# Altium schematic sheet SAML21_Xplained_Pro_current_measurement_frontend.SchDoc: Current measurement frontend
size A3; Organization: ATMEL Norway; Address1: Vestre Rosten 79; Address2: N-7075 TILLER; Address3: NORWAY; DocumentNumber: A09-2241; Revision: 4; SheetNumber: 8; SheetTotal: 10; PageSetup: Record=PageOptions|CenterHorizontal=True|CenterVertical=True|PrintScale=1.01|XCorrection=1.00|YCorrection=1.00|PrintKind=1|BorderSize=5000000|LeftOffset=0|BottomOffset=0|Orientation=2|PaperLength=1000|PaperWidth=1000|Scale=100|PaperSource=7|PrintQuality=-4|MediaType=1|DitherType=10|PaperKind=A3 (297 x 420 mm)|PrintScaleMode=1
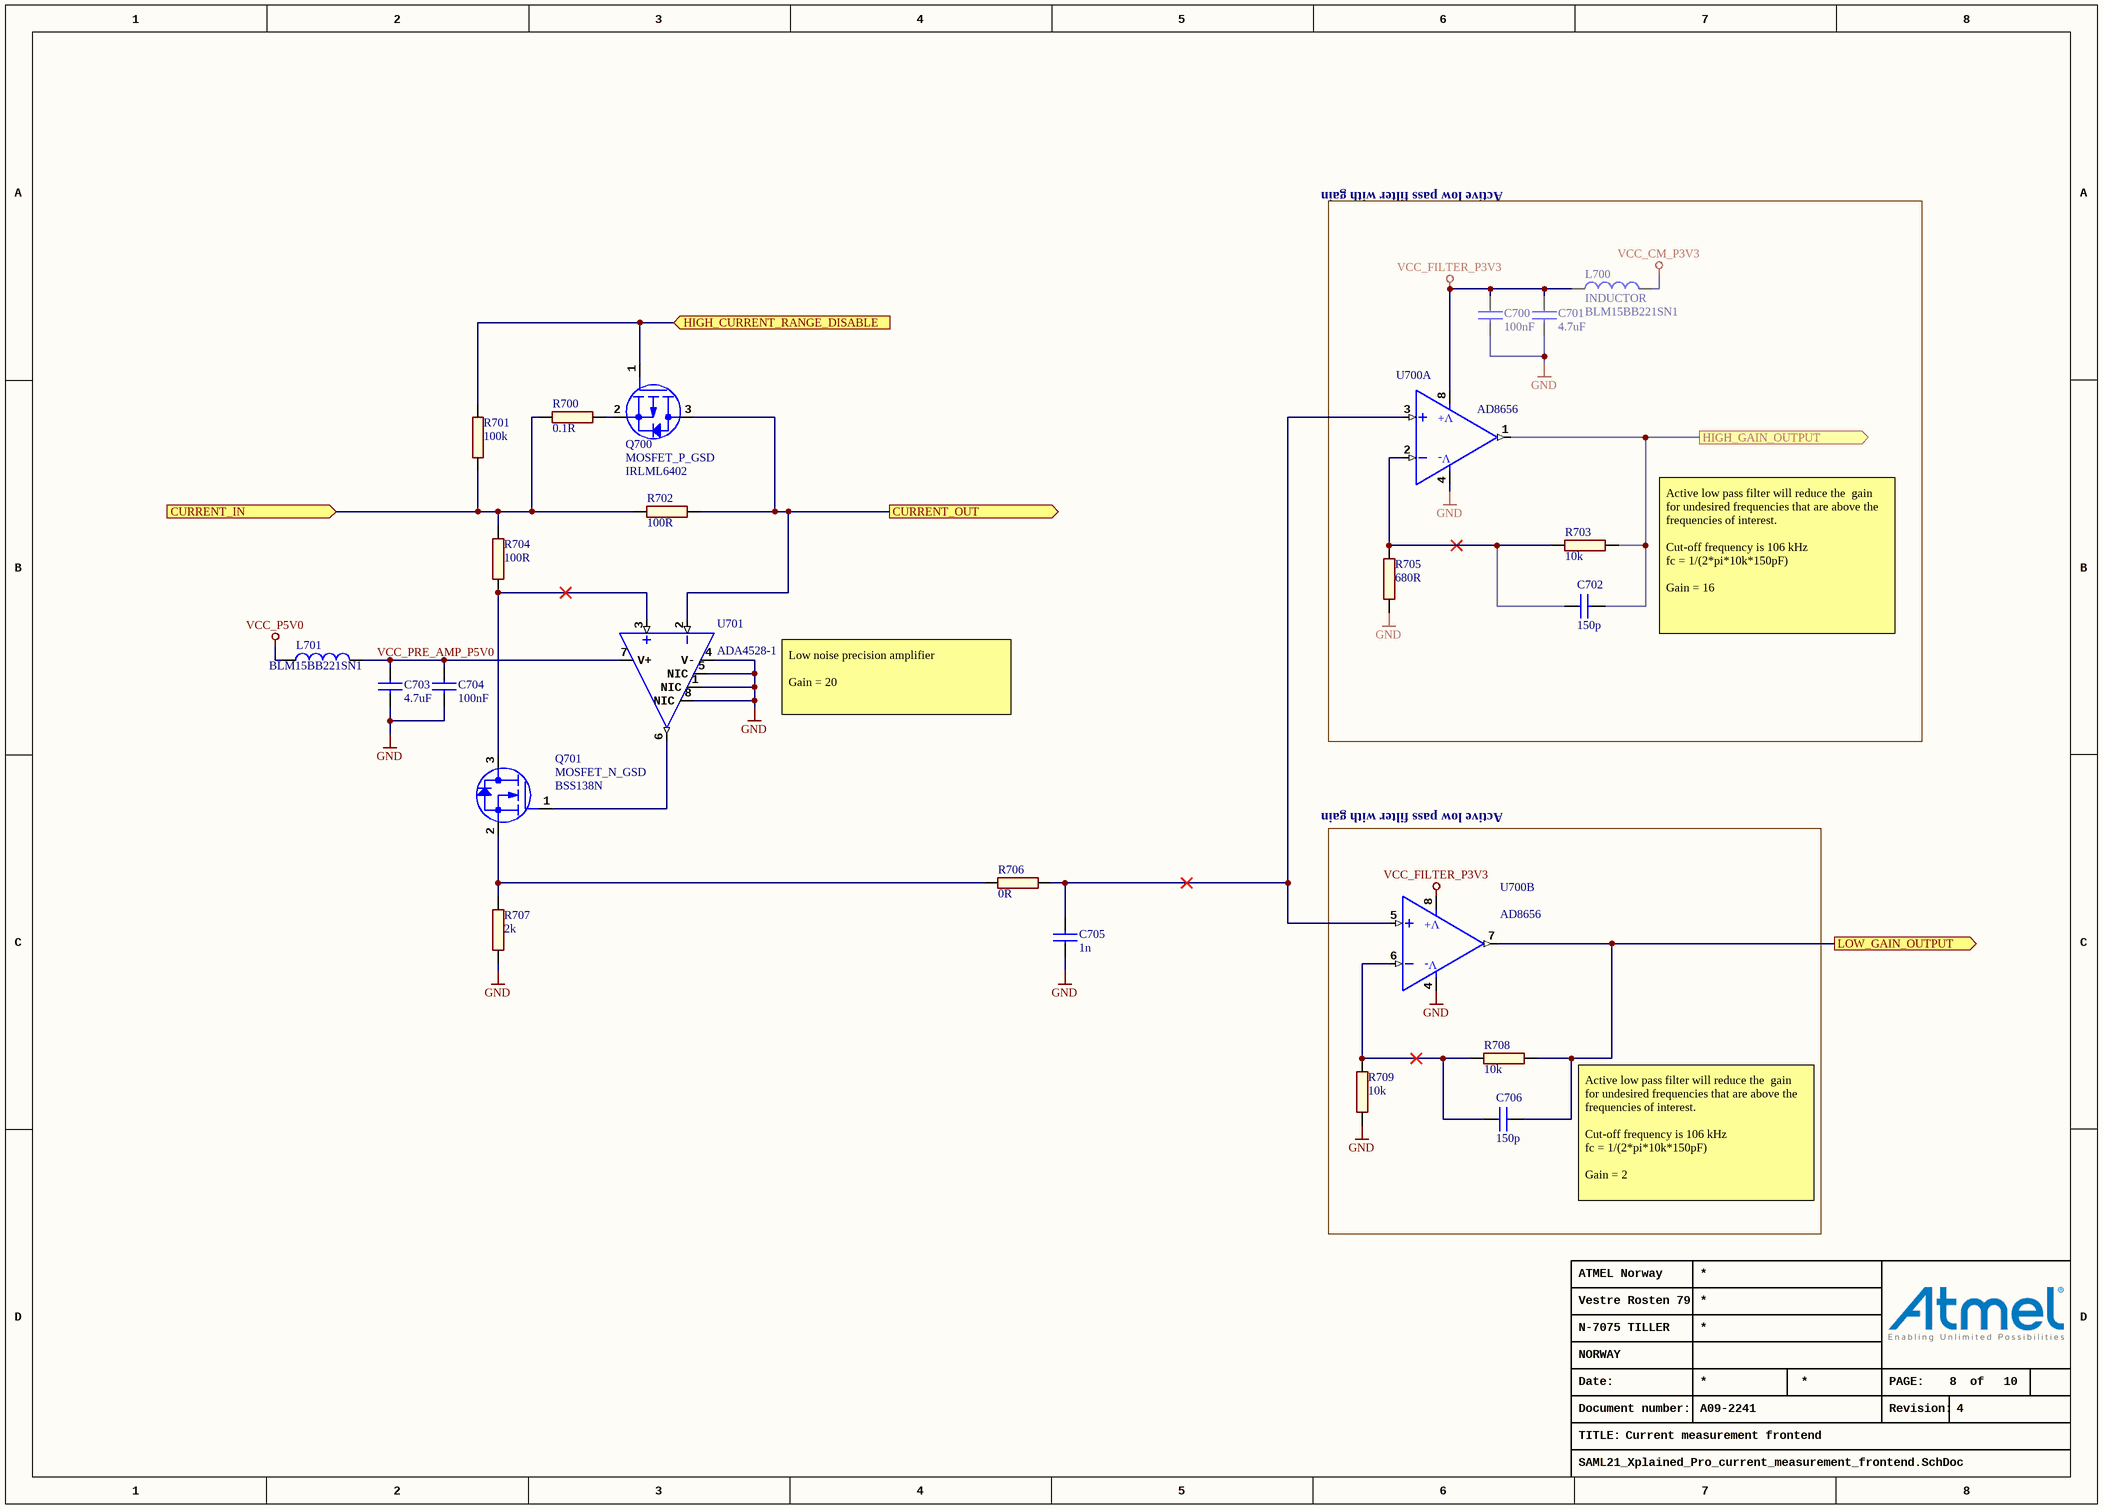
[diagram p0: SAML21_Xplained_Pro_current_measurement_frontend.SchDoc]

## Parts
C700  value 100nF  [AP1-00053]  (hidden comment: CAP-NONPOL)
C701  value 4.7uF  [AP1-00117]  (hidden comment: CAP-NONPOL)
C702  value 150p  [AP1-00053]  (hidden comment: CAP-NONPOL)
C703  value 4.7uF  [AP1-00117]  (hidden comment: CAP-NONPOL)
C704  value 100nF  [AP1-00053]  (hidden comment: CAP-NONPOL)
C705  value 1n  [AP1-00053]  (hidden comment: CAP-NONPOL)
C706  value 150p  [AP1-00053]  (hidden comment: CAP-NONPOL)
L700  INDUCTOR  value BLM15BB221SN1  [AP3-00028]
L701  value BLM15BB221SN1  [AP3-00028]  (hidden comment: INDUCTOR)
Q700  MOSFET_P_GSD  value IRLML6402  [AP5-00002]
Q701  MOSFET_N_GSD  value BSS138N  [AP5-00002]
R700  value 0.1R  [AP2-00076]  (hidden comment: R2)
R701  value 100k  [AP2-00011]  (hidden comment: R2)
R702  value 100R  [AP2-00076]  (hidden comment: R2)
R703  value 10k  [AP2-00011]  (hidden comment: R2)
R704  value 100R  [AP2-00076]  (hidden comment: R2)
R705  value 680R  [AP2-00011]  (hidden comment: R2)
R706  value 0R  [AP2-00011]  (hidden comment: R2)
R707  value 2k  [AP2-00076]  (hidden comment: R2)
R708  value 10k  [AP2-00011]  (hidden comment: R2)
R709  value 10k  [AP2-00011]  (hidden comment: R2)
U700  AD8656  [AP6-00100]  (parts A,B of 2)
U701  ADA4528-1  [AP6-00100]

## Blocks framed on the sheet
Active low pass filter with gain: C700-C702 L700 R703 R705 U700

## Ports
CURRENT_IN (in), CURRENT_OUT (out), HIGH_CURRENT_RANGE_DISABLE (in), HIGH_GAIN_OUTPUT (out), LOW_GAIN_OUTPUT (out)

## Nets
GND: C700.2 C701.2 C703.2 C704.2 C705.1 R705.1 R707.1 R709.1 U700.4(V-) U701.1(NIC) U701.4(V-) U701.5(NIC) U701.8(NIC)
VCC_CM_P3V3: L700.1
VCC_FILTER_P3V3: C700.1 C701.1 L700.2 U700.8(V+)
VCC_P5V0: L701.1
CURRENT_IN: R700.1 R701.1 R702.1 R704.2 ; port CURRENT_IN
CURRENT_OUT: Q700.3(D) R702.2 U701.2(IN-) ; port CURRENT_OUT
HIGH_CURRENT_RANGE_DISABLE: Q700.1(G) R701.2 ; port HIGH_CURRENT_RANGE_DISABLE
HIGH_GAIN_OUTPUT: C702.2 R703.2 U700.1(OUTA) ; port HIGH_GAIN_OUTPUT
LOW_GAIN_OUTPUT: C706.2 R708.2 U700.7(OUTB) ; port LOW_GAIN_OUTPUT
VCC_PRE_AMP_P5V0: C703.1 C704.1 L701.2 U701.7(V+)
NetC702_1: C702.1 R703.1 R705.2 U700.2(INA_-)
NetC705_2: C705.2 R706.1 U700.3(INA_+) U700.5(INB_+)
NetC706_1: C706.1 R708.1 R709.2 U700.6(INB_-)
NetQ700_2: Q700.2(S) R700.2
NetQ701_1: Q701.1(G) U701.6(OUT)
NetQ701_2: Q701.2(S) R706.2 R707.2
NetQ701_3: Q701.3(D) R704.1 U701.3(IN+)

## Notes on the sheet
- Active low pass filter will reduce the  gain for undesired frequencies that are above the frequencies of interest.
  Cut-off frequency is 106 kHz
  fc = 1/(2*pi*10k*150pF)
  Gain = 16
- Low noise precision amplifier
  Gain = 20
- Active low pass filter with gain
- Active low pass filter will reduce the  gain for undesired frequencies that are above the frequencies of interest.
  Cut-off frequency is 106 kHz
  fc = 1/(2*pi*10k*150pF)
  Gain = 2
- Date:
- PAGE:
- of
- TITLE:
- Document number:
- Revision:

## Library data of the parts
C700 C704 = A01-0416: Ceramic capacitor, SMD 0402, High Density Footprint; PartGroup: Capacitors,Ceramic,SMD 0402; Tolerance: 50V, +/-0.25pF; TemperatureRange: -55 - +125 deg C; AN: A01-0416; Height: 0.550000011920929
C701 C703 = A01-0377: Ceramic capacitor, SMD 0603, X5R, 10V, 10% (de31036); PartGroup: Capacitors,Ceramic,SMD 0603; Manufacturer: tdk; MPN: C1608X5R1A475K; TemperatureRange: -55 - +85 deg C; AN: A01-0377; Tolerance: 10%; Height: 0.800000011920929
C702 C706 = A01-0028: Ceramic capacitor, SMD 0402, X7R, 50V, +/-10%; PartGroup: Capacitors,Ceramic,SMD 0402; TemperatureRange: -55 - +125 deg C; AN: A01-0028; Tolerance: 50V, +/-10%; Height: 0.550000011920929
C705 = A01-0038: Ceramic capacitor, SMD 0402, X7R, 50V, +/-10%; PartGroup: Capacitors,Ceramic,SMD 0402; TemperatureRange: -55 - +125 deg C; AN: A01-0038; Tolerance: 50V, +/-10%; Height: 0.550000011920929
L700 L701 = A03-0037: SMD RF inductor 0402. Z=220Ohm (@100MHz), Max R(dc)=0.80Ohm, Max current=200mA; PartGroup: Inductors,EMI; Manufacturer: Murata; Tolerance: ±25%; TemperatureRange: -55°C to +125°C; AN: A03-0037; Height: 0.5; MPN: BLM15BB221SN1
Q700 = A05-0087: P-ch. MOSFET. -30V, -3.7A continuous,RDS(ON)=0.05Ohm@VGS=-4,5V, RDS(ON)=0.08Ohm@VGS=-2.5V; PartGroup: Transistors,Power FET,SMD; Manufacturer: International Rectifier; MPN: IRLML6402PBF; TemperatureRange: -55 - +150 deg C; AN: A05-0087; Height: 1.14999997615814
Q701 = A05-0140: Low leakage N-Channel MOSFET. 60V, 0.23A continuous, 0.92A Peak. RDS(ON) = 3.5Ohm@VGS=4.5V, VGS(th)<1.4V; PartGroup: Transistors,Small signal FET,SMD; Manufacturer: Infineon; TemperatureRange: -55  to +150 deg celcius; AN: A05-0140; Height: 1.10000002384186; MPN: BSS138N
R700 = A02-0896: WSL0603R1000FEA, metal strip resistor, 0.1 Ohm, +-1%, 0603 SMD, 1/10 W, TEMPCO +-75 ppm/Â°C; PartGroup: Resistors,Sense resistors,SMD Current Sense; Manufacturer: vishay; AN: A02-0896; Height: 0.330000013113022; MPN: WSL0603R1000FEA
R701 = A02-0260: Thick film resistor, SMD 0402, 1/16W, 1%; PartGroup: Resistors,SMD,0402 1%; TemperatureRange: -55ï¿½ to +125ï¿½C; AN: A02-0260; Tolerance: 1 %; Height: 0.349999994039536
R702 R704 = A02-0895: ERA-3YEB101V, metal film, 100R Â±0.1%, resistor in 0603 at 100mW, TEMPCO Â±25ppm/Â°C, Max V=75V; PartGroup: Resistors,Metal film,SMD Precision resistors; Manufacturer: Panasonic; MPN: ERA3YEB101V; AN: A02-0895; Height: 0.550000011920929
R703 R708 R709 = A02-0236: Thick film resistor, SMD 0402, 1/16W, 1%; PartGroup: Resistors,SMD,0402 1%; Manufacturer: vishay; MPN: CRCW040210K0FKED; TemperatureRange: -55 - +125 deg C; AN: A02-0236; Tolerance: 1 %; Height: 0.349999994039536
R705 = A02-0208: Thick film resistor, SMD 0402, 1/16W, 1%; PartGroup: Resistors,SMD,0402 1%; TemperatureRange: -55 - +125 deg C; AN: A02-0208; Tolerance: 1 %; Height: 0.349999994039536
R706 = A02-0163: RES 0.0 OHM 1/16W 0402 SMD; PartGroup: Resistors,SMD,0402 1%; Manufacturer: (n/a); MPN: RMCF0402ZT0R00; Tolerance: 1 %; TemperatureRange: -55 - +125 deg C; AN: A02-0163; Height: 0.349999994039536
R707 = A02-0081: Thick film resistor, SMD 0603, 1/10W, 1%; PartGroup: Resistors,SMD,0603 1%; AN: A02-0081; Tolerance: 1 %; Height: 0.5
U700 = A06-1125: AD8656, dual low noise precision OpAmp, rail-to-rail, low offset 250uV, GBP 28 MHz, 8MSOP; PartGroup: Integrated Circuits,General linear,OP-AMP; Manufacturer: Analog Devices; MPN: AD8656ARMZ; TemperatureRange: -40 to +125 deg celcius; AN: A06-1125; Value: AD8656; Height: 1.10000002384186
U701 = A06-1134: Precision OpAmp, Zero-Drift 0.015uV/K, ultra low noise 5.6nV/sqrt(Hz), Vo=2uV, GBW=4MHz, single supply 2.2V to 5.5V or dual supply +-1V to +-2.75V, rail to rail, unity gain stable; PartGroup: Integrated Circuits,General linear,OP-AMP; Manufacturer: Analog Devices; MPN: ADA4528-1ARMZ; AN: A06-1134; Value: ADA4528-1; Height: 1.10000002384186